# Altium schematic sheet Input_Conditioning.SchDoc
size A4
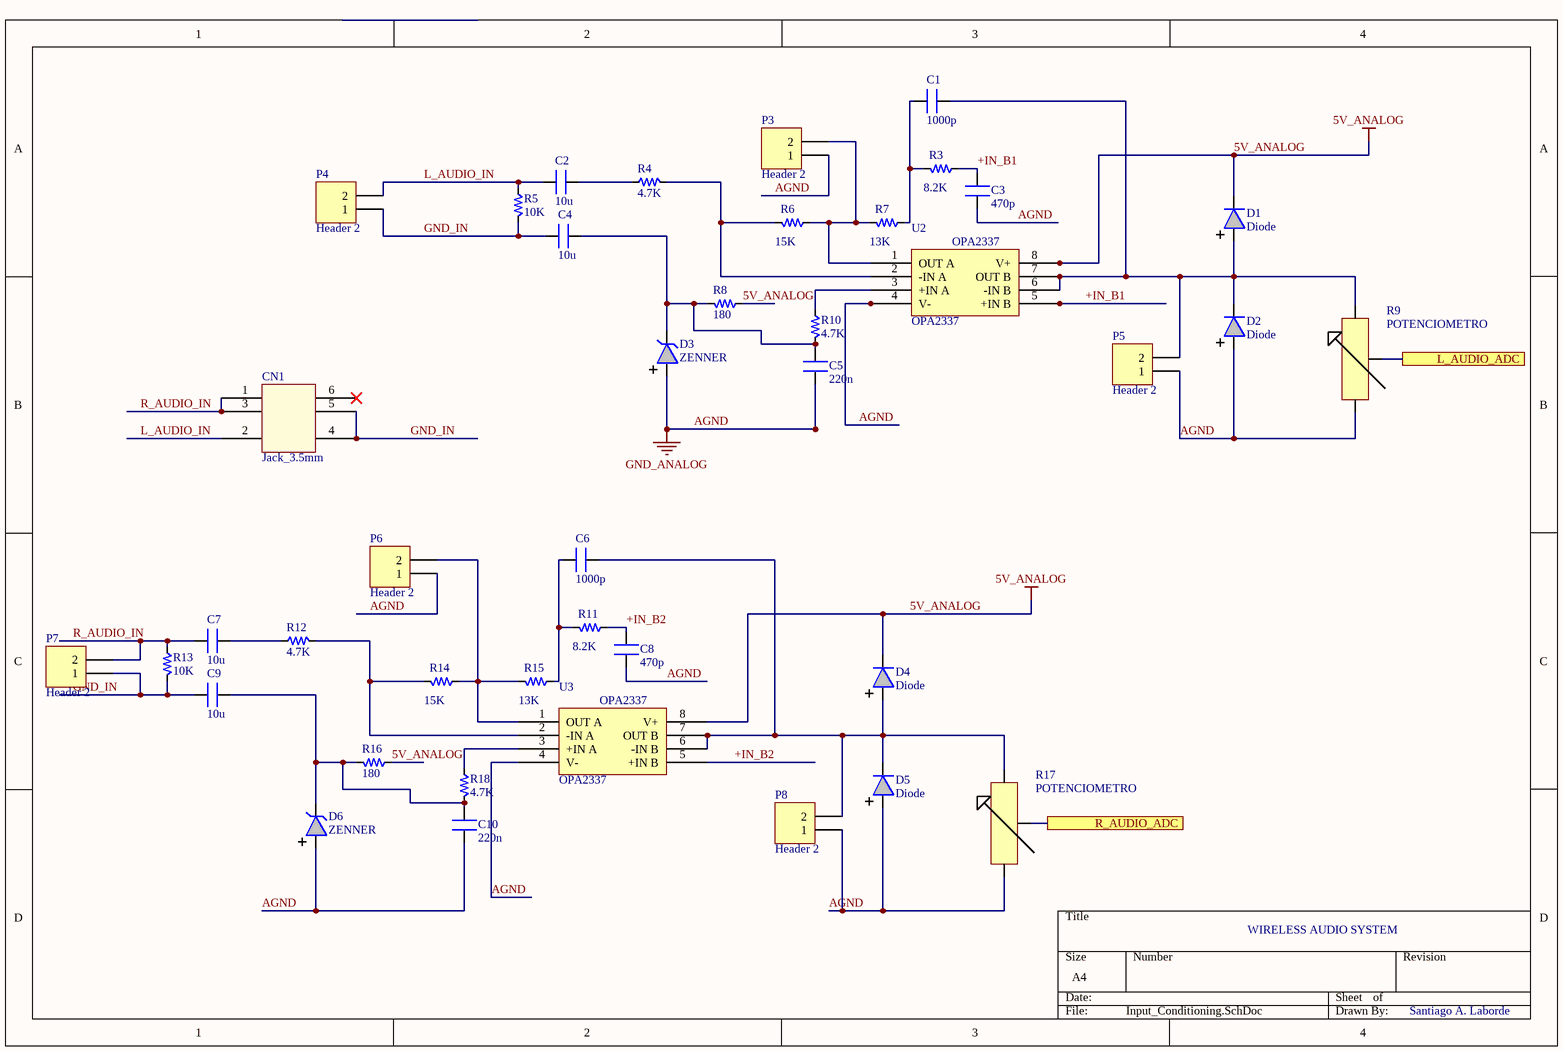
[diagram p0: Input_Conditioning.SchDoc]

## Parts
C1  1000p  [C_0805]
C2  10u  [RAD-0.1]
C3  470p  [C_0805]
C4  10u  [RAD-0.1]
C5  220n  [C_0805]
C6  1000p  [C_0805]
C7  10u  [RAD-0.1]
C8  470p  [C_0805]
C9  10u  [RAD-0.1]
C10  220n  [C_0805]
CN1  Jack_3.5mm  [JACK_3.5mm]
D1  Diode  [LED_0805]
D2  Diode  [LED_0805]
D3  ZENNER  [SOD123]
D4  Diode  [LED_0805]
D5  Diode  [LED_0805]
D6  ZENNER  [SOD123]
P3  Header 2  [Header1x2]
P4  Header 2  [Header1x2]
P5  Header 2  [Header1x2]
P6  Header 2  [Header1x2]
P7  Header 2  [Header1x2]
P8  Header 2  [Header1x2]
R3  8.2K  [R_0805]
R4  4.7K  [R_0805]
R5  10K  [R_0805]
R6  15K  [R_0805]
R7  13K  [R_0805]
R8  180  [R_0805]
R9  POTENCIOMETRO  [Potenciometro]
R10  4.7K  [R_0805]
R11  8.2K  [R_0805]
R12  4.7K  [R_0805]
R13  10K  [R_0805]
R14  15K  [R_0805]
R15  13K  [R_0805]
R16  180  [R_0805]
R17  POTENCIOMETRO  [Potenciometro]
R18  4.7K  [R_0805]
U2  OPA2337  [SOIC-8N]
U3  OPA2337  [SOIC-8N]

## Ports
L_AUDIO_ADC, R_AUDIO_ADC

## Nets
5V_ANALOG: D1.2 D4.2 R8.2 R16.2 U2.8(V+) U3.8(V+)
AGND: C3.2 C5.2 C8.2 C10.2 D2.1 D3.1 D5.1 D6.1 P3.1 P5.1 P6.1 P8.1 R9.2 R17.2 U2.4(V-) U3.4(V-)  [also labelled GND_ANALOG]
+IN_B1: C3.1 R3.2 U2.5(+IN_B)
+IN_B2: C8.1 R11.2 U3.5(+IN_B)
GND_IN: C4.1 C9.1 CN1.4 CN1.5 P4.1 P7.1 R5.1 R13.1
L_AUDIO_ADC: R9.3 ; port L_AUDIO_ADC
L_AUDIO_IN: C2.2 CN1.2 P4.2 R5.2
R_AUDIO_ADC: R17.3 ; port R_AUDIO_ADC
R_AUDIO_IN: C7.2 CN1.1 CN1.3 P7.2 R13.2
NetC1_1: C1.1 R3.1 R7.2
NetC1_2: C1.2 D1.1 D2.2 P5.2 R9.1 U2.6(-IN_B) U2.7(OUT_B)
NetC2_1: C2.1 R4.2
NetC4_2: C4.2 C5.1 D3.2 R8.1 R10.1
NetC6_1: C6.1 R11.1 R15.2
NetC6_2: C6.2 D4.1 D5.2 P8.2 R17.1 U3.6(-IN_B) U3.7(OUT_B)
NetC7_1: C7.1 R12.2
NetC9_2: C9.2 C10.1 D6.2 R16.1 R18.1
NetP3_2: P3.2 R6.2 R7.1 U2.1(OUT_A)
NetP6_2: P6.2 R14.2 R15.1 U3.1(OUT_A)
NetR4_1: R4.1 R6.1 U2.2(-IN_A)
NetR10_2: R10.2 U2.3(+IN_A)
NetR12_1: R12.1 R14.1 U3.2(-IN_A)
NetR18_2: R18.2 U3.3(+IN_A)

Not connected (* = marked no-connect by the designer): CN1 6*

## Notes on the sheet
- WIRELESS AUDIO SYSTEM
- Santiago A. Laborde

## Library data of the parts
C1-C10 = Capacitor_NP: Non Polarised Capacitor
P3-P8 = Header 2: Header, 2-Pin; LatestRevisionDate: 17-Jul-2002; LatestRevisionNote: Re-released for DXP Platform.; Publisher: Altium Limited
R3-R8 R10-R16 R18 = Resistor
R9 R17 = POTENCIOMETRO: pin to pad: 1>3 2>1 3>2